# EAGLE design a2-display (EAGLE 6.6.0)
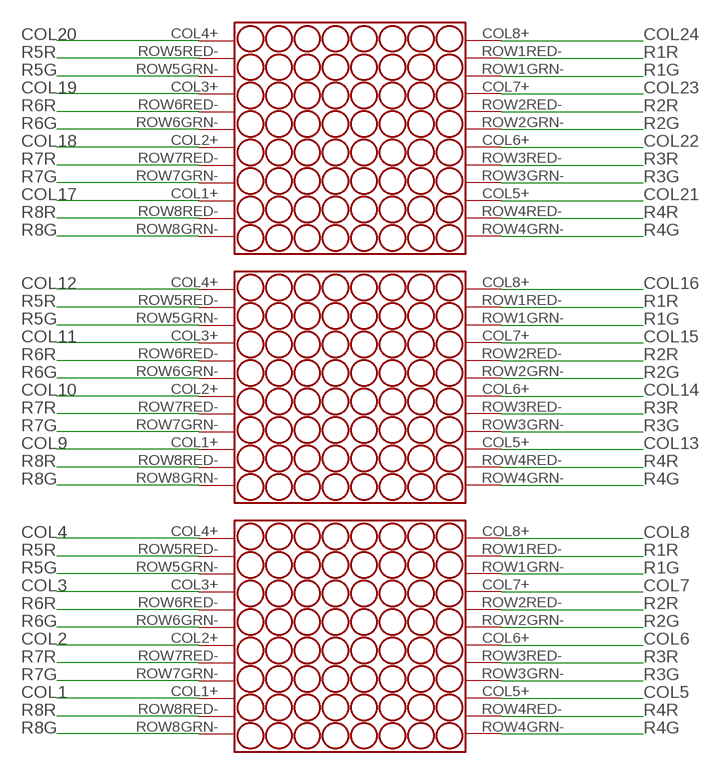
[diagram p0: schematic, sheet 1, part 1 of 2]
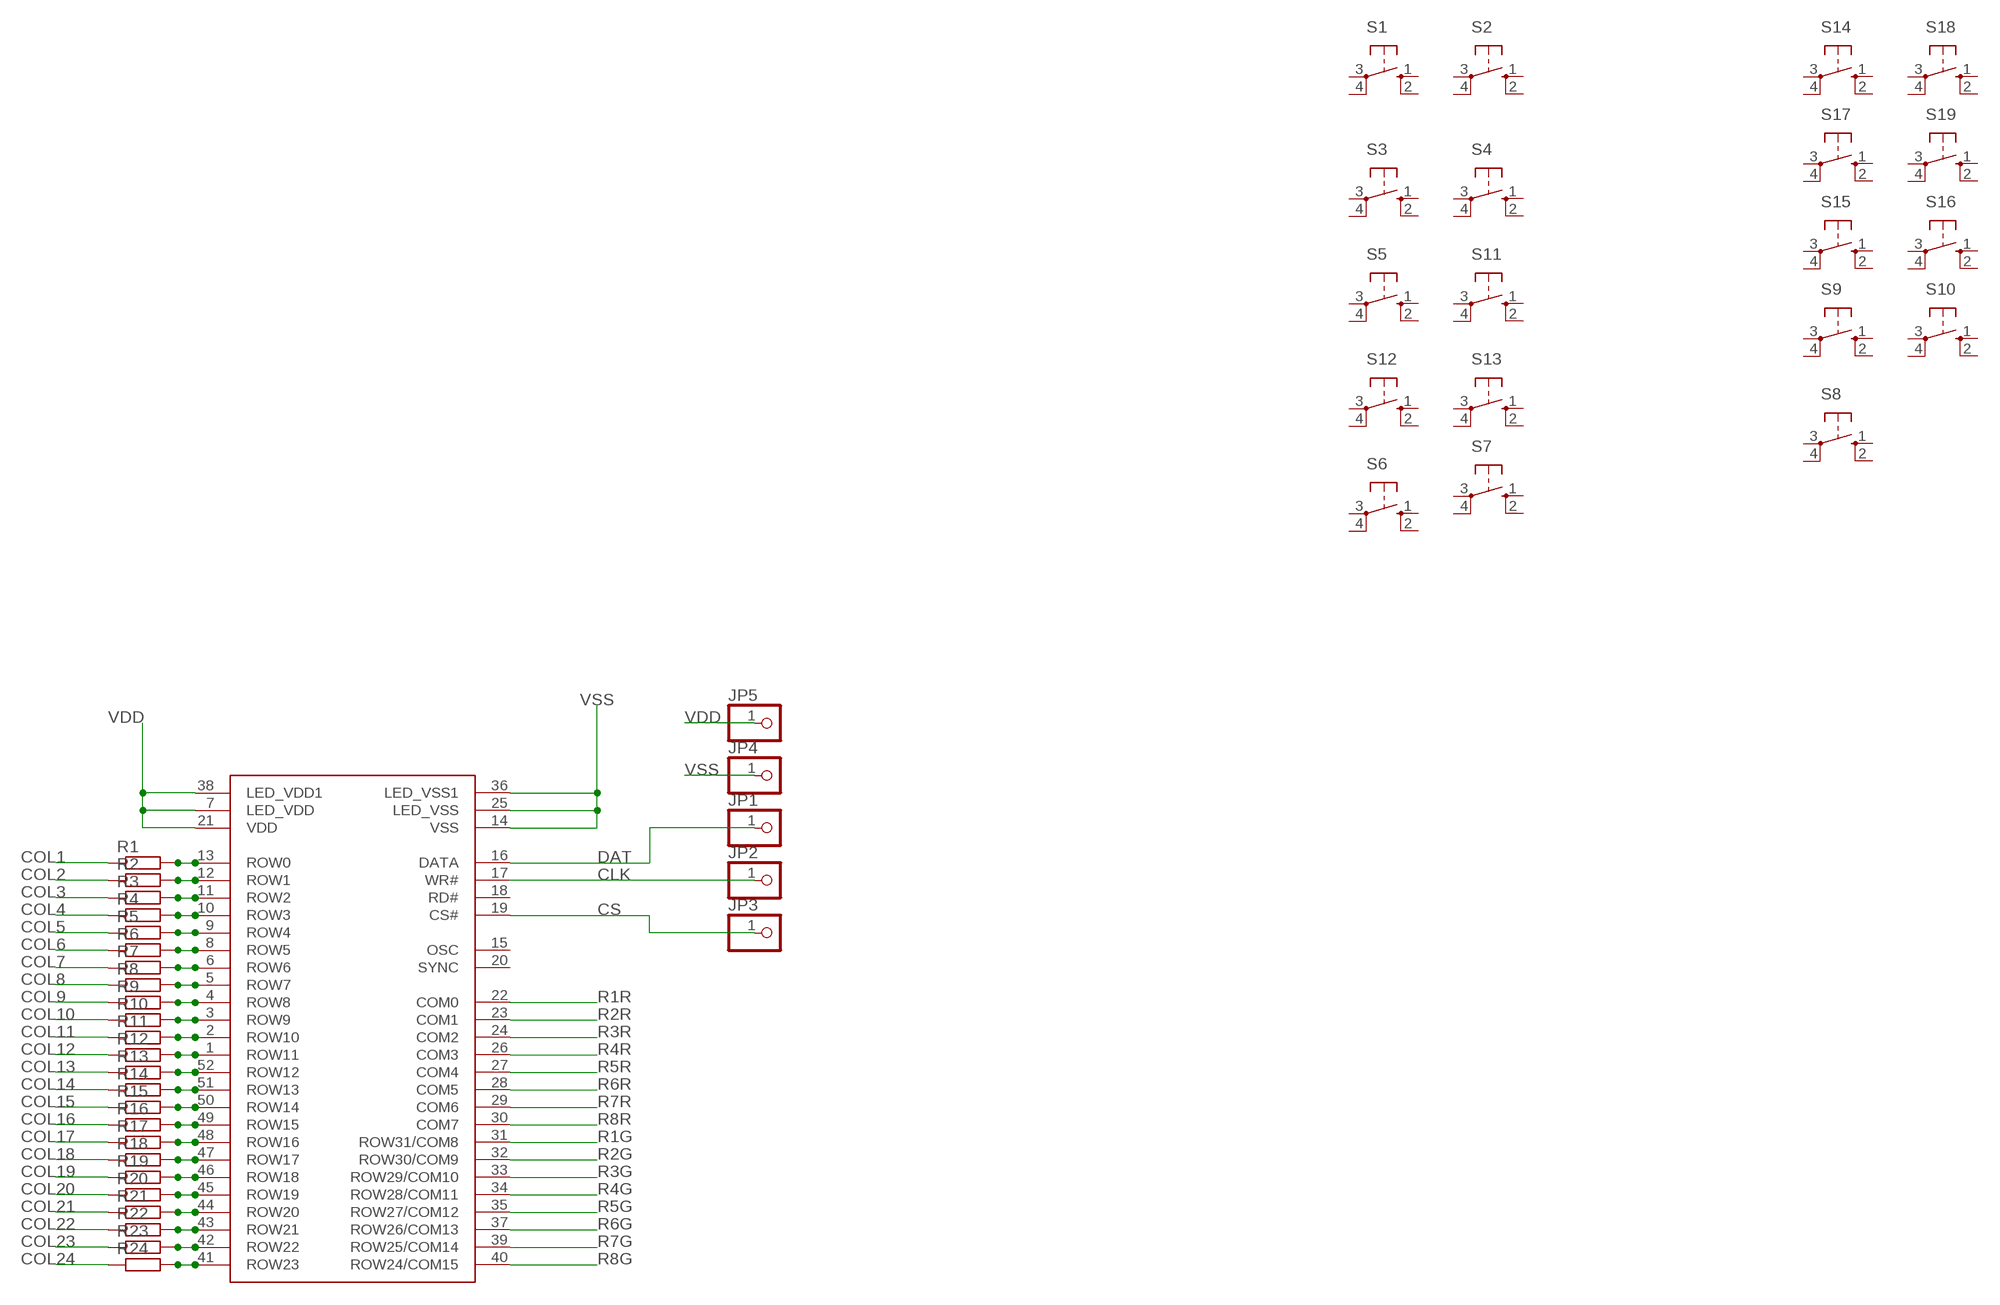
[diagram p1: schematic, sheet 1, part 2 of 2]

## Parts
IC1  HT1632C  [QFP52]
JP1  PINHD-1X1  [1X01]
JP2  PINHD-1X1  [1X01]
JP3  PINHD-1X1  [1X01]
JP4  PINHD-1X1  [1X01]
JP5  PINHD-1X1  [1X01]
R1  R-EU_R0805  [R0805]
R2  R-EU_R0805  [R0805]
R3  R-EU_R0805  [R0805]
R4  R-EU_R0805  [R0805]
R5  R-EU_R0805  [R0805]
R6  R-EU_R0805  [R0805]
R7  R-EU_R0805  [R0805]
R8  R-EU_R0805  [R0805]
R9  R-EU_R0805  [R0805]
R10  R-EU_R0805  [R0805]
R11  R-EU_R0805  [R0805]
R12  R-EU_R0805  [R0805]
R13  R-EU_R0805  [R0805]
R14  R-EU_R0805  [R0805]
R15  R-EU_R0805  [R0805]
R16  R-EU_R0805  [R0805]
R17  R-EU_R0805  [R0805]
R18  R-EU_R0805  [R0805]
R19  R-EU_R0805  [R0805]
R20  R-EU_R0805  [R0805]
R21  R-EU_R0805  [R0805]
R22  R-EU_R0805  [R0805]
R23  R-EU_R0805  [R0805]
R24  R-EU_R0805  [R0805]
S1  10-XX  [B3F-10XX]
S2  10-XX  [B3F-10XX]
S3  10-XX  [B3F-10XX]
S4  10-XX  [B3F-10XX]
S5  10-XX  [B3F-10XX]
S6  10-XX  [B3F-10XX]
S7  10-XX  [B3F-10XX]
S8  10-XX  [B3F-10XX]
S9  10-XX  [B3F-10XX]
S10  10-XX  [B3F-10XX]
S11  10-XX  [B3F-10XX]
S12  10-XX  [B3F-10XX]
S13  10-XX  [B3F-10XX]
S14  10-XX  [B3F-10XX]
S15  10-XX  [B3F-10XX]
S16  10-XX  [B3F-10XX]
S17  10-XX  [B3F-10XX]
S18  10-XX  [B3F-10XX]
S19  10-XX  [B3F-10XX]
U$1  8X8  [SURE8X8]
U$2  8X8  [SURE8X8]
U$3  8X8  [SURE8X8]

## Nets
CLK: IC1.17(WR#) JP2.1
COL1: R1.1 U$3.COL1+(COL1_AN)
COL2: R2.1 U$3.COL2+(COL2_AN)
COL3: R3.1 U$3.COL3+(COL3_AN)
COL4: R4.1 U$3.COL4+(COL4_AN)
COL5: R5.1 U$3.COL5+(COL5_AN)
COL6: R6.1 U$3.COL6+(COL6_AN)
COL7: R7.1 U$3.COL7+(COL7_AN)
COL8: R8.1 U$3.COL8+(COL8_AN)
COL9: R9.1 U$2.COL1+(COL1_AN)
COL10: R10.1 U$2.COL2+(COL2_AN)
COL11: R11.1 U$2.COL3+(COL3_AN)
COL12: R12.1 U$2.COL4+(COL4_AN)
COL13: R13.1 U$2.COL5+(COL5_AN)
COL14: R14.1 U$2.COL6+(COL6_AN)
COL15: R15.1 U$2.COL7+(COL7_AN)
COL16: R16.1 U$2.COL8+(COL8_AN)
COL17: R17.1 U$1.COL1+(COL1_AN)
COL18: R18.1 U$1.COL2+(COL2_AN)
COL19: R19.1 U$1.COL3+(COL3_AN)
COL20: R20.1 U$1.COL4+(COL4_AN)
COL21: R21.1 U$1.COL5+(COL5_AN)
COL22: R22.1 U$1.COL6+(COL6_AN)
COL23: R23.1 U$1.COL7+(COL7_AN)
COL24: R24.1 U$1.COL8+(COL8_AN)
CS: IC1.19(CS#) JP3.1
DAT: IC1.16(DATA) JP1.1
N$1: IC1.13(ROW0) R1.2
N$2: IC1.12(ROW1) R2.2
N$3: IC1.11(ROW2) R3.2
N$4: IC1.10(ROW3) R4.2
N$5: IC1.9(ROW4) R5.2
N$6: IC1.8(ROW5) R6.2
N$7: IC1.6(ROW6) R7.2
N$8: IC1.5(ROW7) R8.2
N$9: IC1.4(ROW8) R9.2
N$10: IC1.3(ROW9) R10.2
N$11: IC1.2(ROW10) R11.2
N$12: IC1.1(ROW11) R12.2
N$13: IC1.52(ROW12) R13.2
N$14: IC1.51(ROW13) R14.2
N$15: IC1.50(ROW14) R15.2
N$16: IC1.49(ROW15) R16.2
N$17: IC1.48(ROW16) R17.2
N$18: IC1.47(ROW17) R18.2
N$19: IC1.46(ROW18) R19.2
N$20: IC1.45(ROW19) R20.2
N$21: IC1.44(ROW20) R21.2
N$22: IC1.43(ROW21) R22.2
N$23: IC1.42(ROW22) R23.2
N$24: IC1.41(ROW23) R24.2
R1G: IC1.31(ROW31/COM8) U$1.ROW1GRN-(GRN1_CA) U$2.ROW1GRN-(GRN1_CA) U$3.ROW1GRN-(GRN1_CA)
R1R: IC1.22(COM0) U$1.ROW1RED-(RED1_CA) U$2.ROW1RED-(RED1_CA) U$3.ROW1RED-(RED1_CA)
R2G: IC1.32(ROW30/COM9) U$1.ROW2GRN-(GRN2_CA) U$2.ROW2GRN-(GRN2_CA) U$3.ROW2GRN-(GRN2_CA)
R2R: IC1.23(COM1) U$1.ROW2RED-(RED2_CA) U$2.ROW2RED-(RED2_CA) U$3.ROW2RED-(RED2_CA)
R3G: IC1.33(ROW29/COM10) U$1.ROW3GRN-(GRN3_CA) U$2.ROW3GRN-(GRN3_CA) U$3.ROW3GRN-(GRN3_CA)
R3R: IC1.24(COM2) U$1.ROW3RED-(RED3_CA) U$2.ROW3RED-(RED3_CA) U$3.ROW3RED-(RED3_CA)
R4G: IC1.34(ROW28/COM11) U$1.ROW4GRN-(GRN4_CA) U$2.ROW4GRN-(GRN4_CA) U$3.ROW4GRN-(GRN4_CA)
R4R: IC1.26(COM3) U$1.ROW4RED-(RED4_CA) U$2.ROW4RED-(RED4_CA) U$3.ROW4RED-(RED4_CA)
R5G: IC1.35(ROW27/COM12) U$1.ROW5GRN-(GRN5_CA) U$2.ROW5GRN-(GRN5_CA) U$3.ROW5GRN-(GRN5_CA)
R5R: IC1.27(COM4) U$1.ROW5RED-(RED5_CA) U$2.ROW5RED-(RED5_CA) U$3.ROW5RED-(RED5_CA)
R6G: IC1.37(ROW26/COM13) U$1.ROW6GRN-(GRN6_CA) U$2.ROW6GRN-(GRN6_CA) U$3.ROW6GRN-(GRN6_CA)
R6R: IC1.28(COM5) U$1.ROW6RED-(RED6_CA) U$2.ROW6RED-(RED6_CA) U$3.ROW6RED-(RED6_CA)
R7G: IC1.39(ROW25/COM14) U$1.ROW7GRN-(GRN7_CA) U$2.ROW7GRN-(GRN7_CA) U$3.ROW7GRN-(GRN7_CA)
R7R: IC1.29(COM6) U$1.ROW7RED-(RED7_CA) U$2.ROW7RED-(RED7_CA) U$3.ROW7RED-(RED7_CA)
R8G: IC1.40(ROW24/COM15) U$1.ROW8GRN-(GRN8_CA) U$2.ROW8GRN-(GRN8_CA) U$3.ROW8GRN-(GRN8_CA)
R8R: IC1.30(COM7) U$1.ROW8RED-(RED8_CA) U$2.ROW8RED-(RED8_CA) U$3.ROW8RED-(RED8_CA)
VDD: IC1.7(LED_VDD) IC1.21(VDD) IC1.38(LED_VDD1) JP5.1
VSS: IC1.14(VSS) IC1.25(LED_VSS) IC1.36(LED_VSS1) JP4.1
Unconnected: IC1.15(OSC) IC1.18(RD#) IC1.20(SYNC) S1.1(S) S1.2(S1) S1.3(P) S1.4(P1) S2.1(S) S2.2(S1) S2.3(P) S2.4(P1) S3.1(S) S3.2(S1) S3.3(P) S3.4(P1) S4.1(S) S4.2(S1) S4.3(P) S4.4(P1) S5.1(S) S5.2(S1) S5.3(P) S5.4(P1) S6.1(S) S6.2(S1) S6.3(P) S6.4(P1) S7.1(S) S7.2(S1) S7.3(P) S7.4(P1) S8.1(S) S8.2(S1) S8.3(P) S8.4(P1) S9.1(S) S9.2(S1) S9.3(P) S9.4(P1) S10.1(S) S10.2(S1) S10.3(P) S10.4(P1) S11.1(S) S11.2(S1) S11.3(P) S11.4(P1) S12.1(S) S12.2(S1) S12.3(P) S12.4(P1) S13.1(S) S13.2(S1) S13.3(P) S13.4(P1) S14.1(S) S14.2(S1) S14.3(P) S14.4(P1) S15.1(S) S15.2(S1) S15.3(P) S15.4(P1) S16.1(S) S16.2(S1) S16.3(P) S16.4(P1) S17.1(S) S17.2(S1) S17.3(P) S17.4(P1) S18.1(S) S18.2(S1) S18.3(P) S18.4(P1) S19.1(S) S19.2(S1) S19.3(P) S19.4(P1)

## Library data of the parts
IC1 = jason_eagle6:HT1632C
JP1-JP5 = pinhead:PINHD-1X1: PIN HEADER
R1-R24 = rcl:R-EU_: RESISTOR, European symbol
S1-S19 = switch-omron:10-XX: OMRON SWITCH; MPN: B3F-1000; OC_FARNELL: 176432; OC_NEWARK: 36M3542
U$1-U$3 = jasons_stuff:8X8: Sure Electronics 8x8 Bi Colour LED matrix

## Board
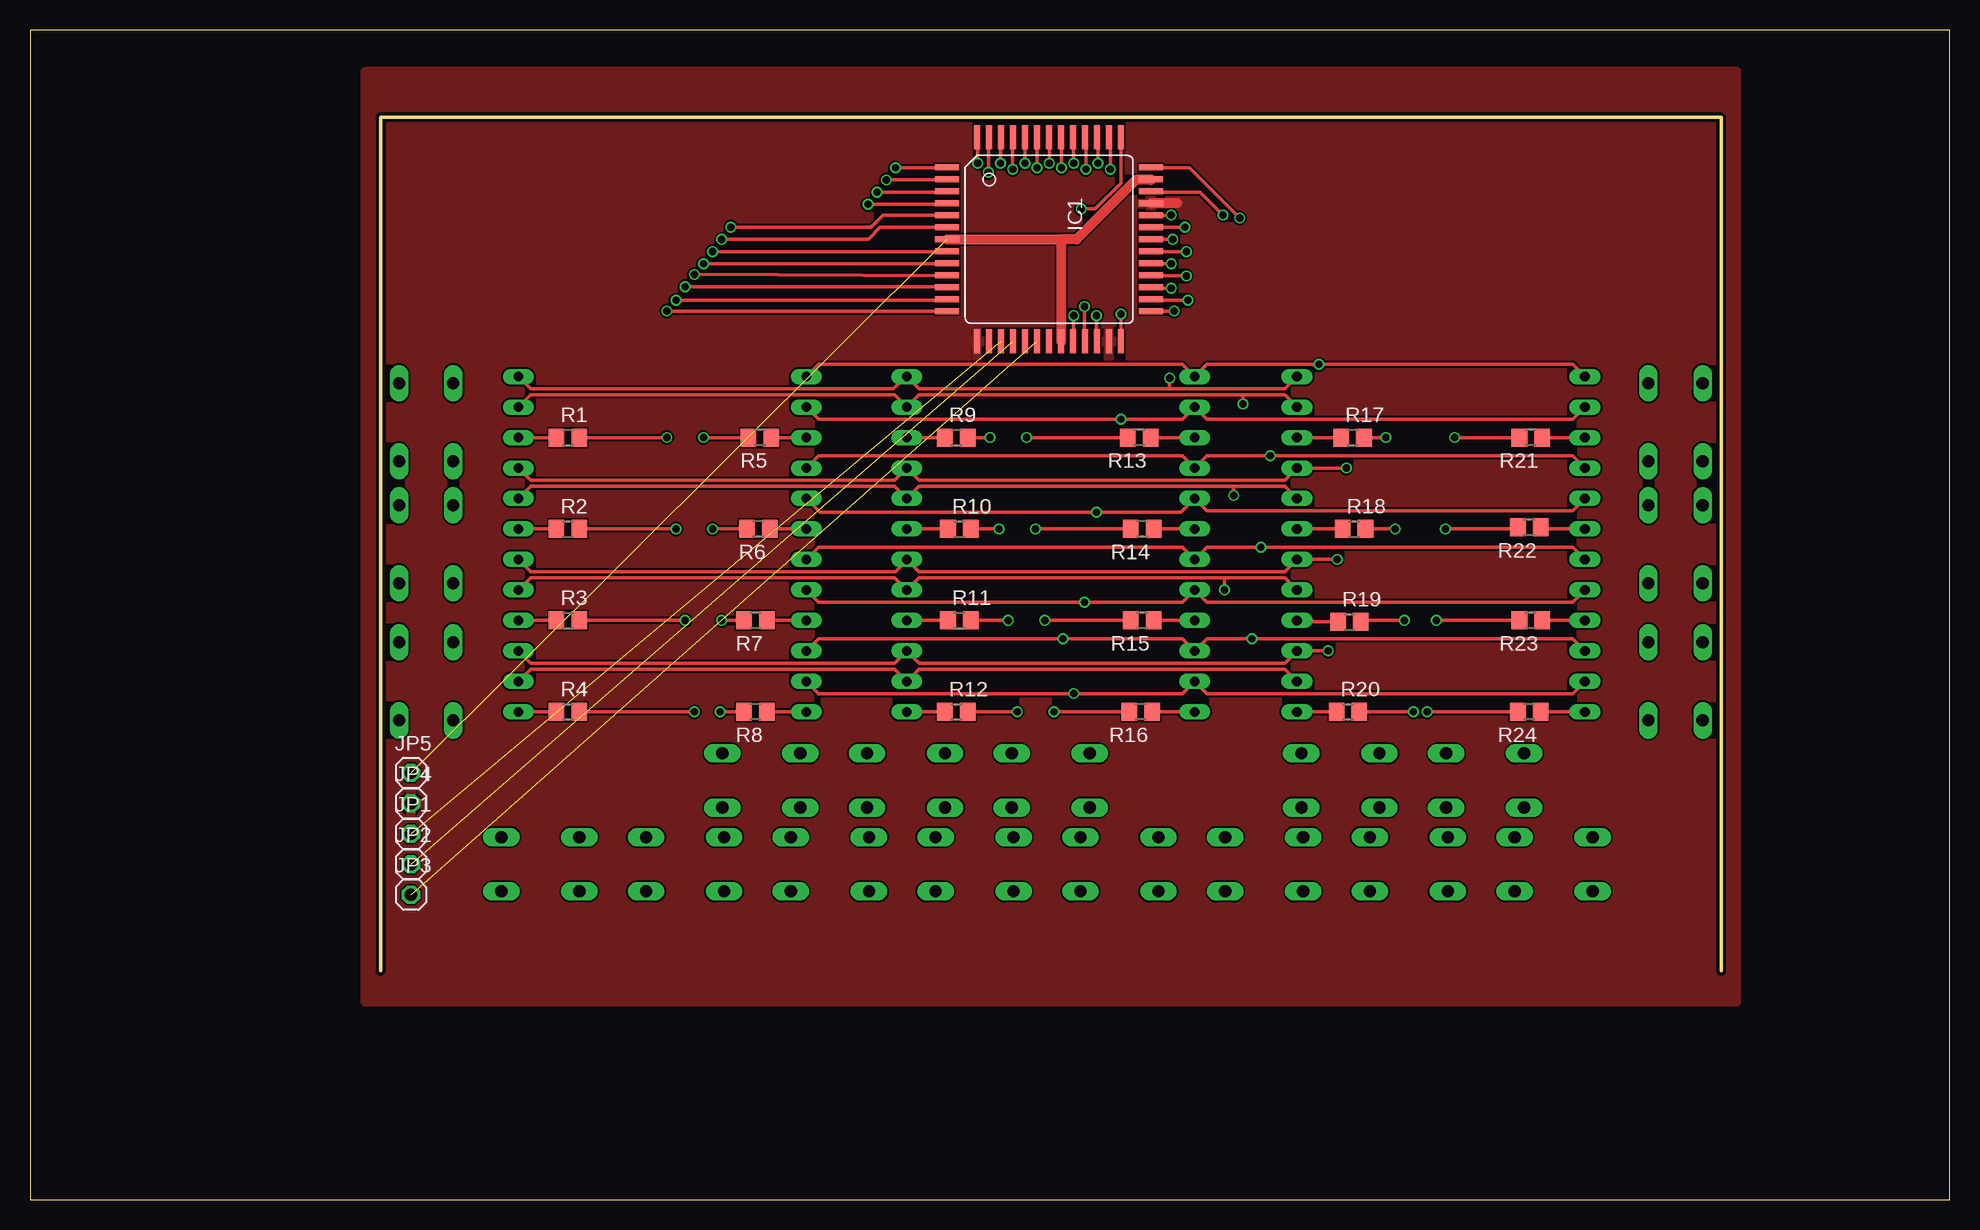
[diagram p2: board, top side]
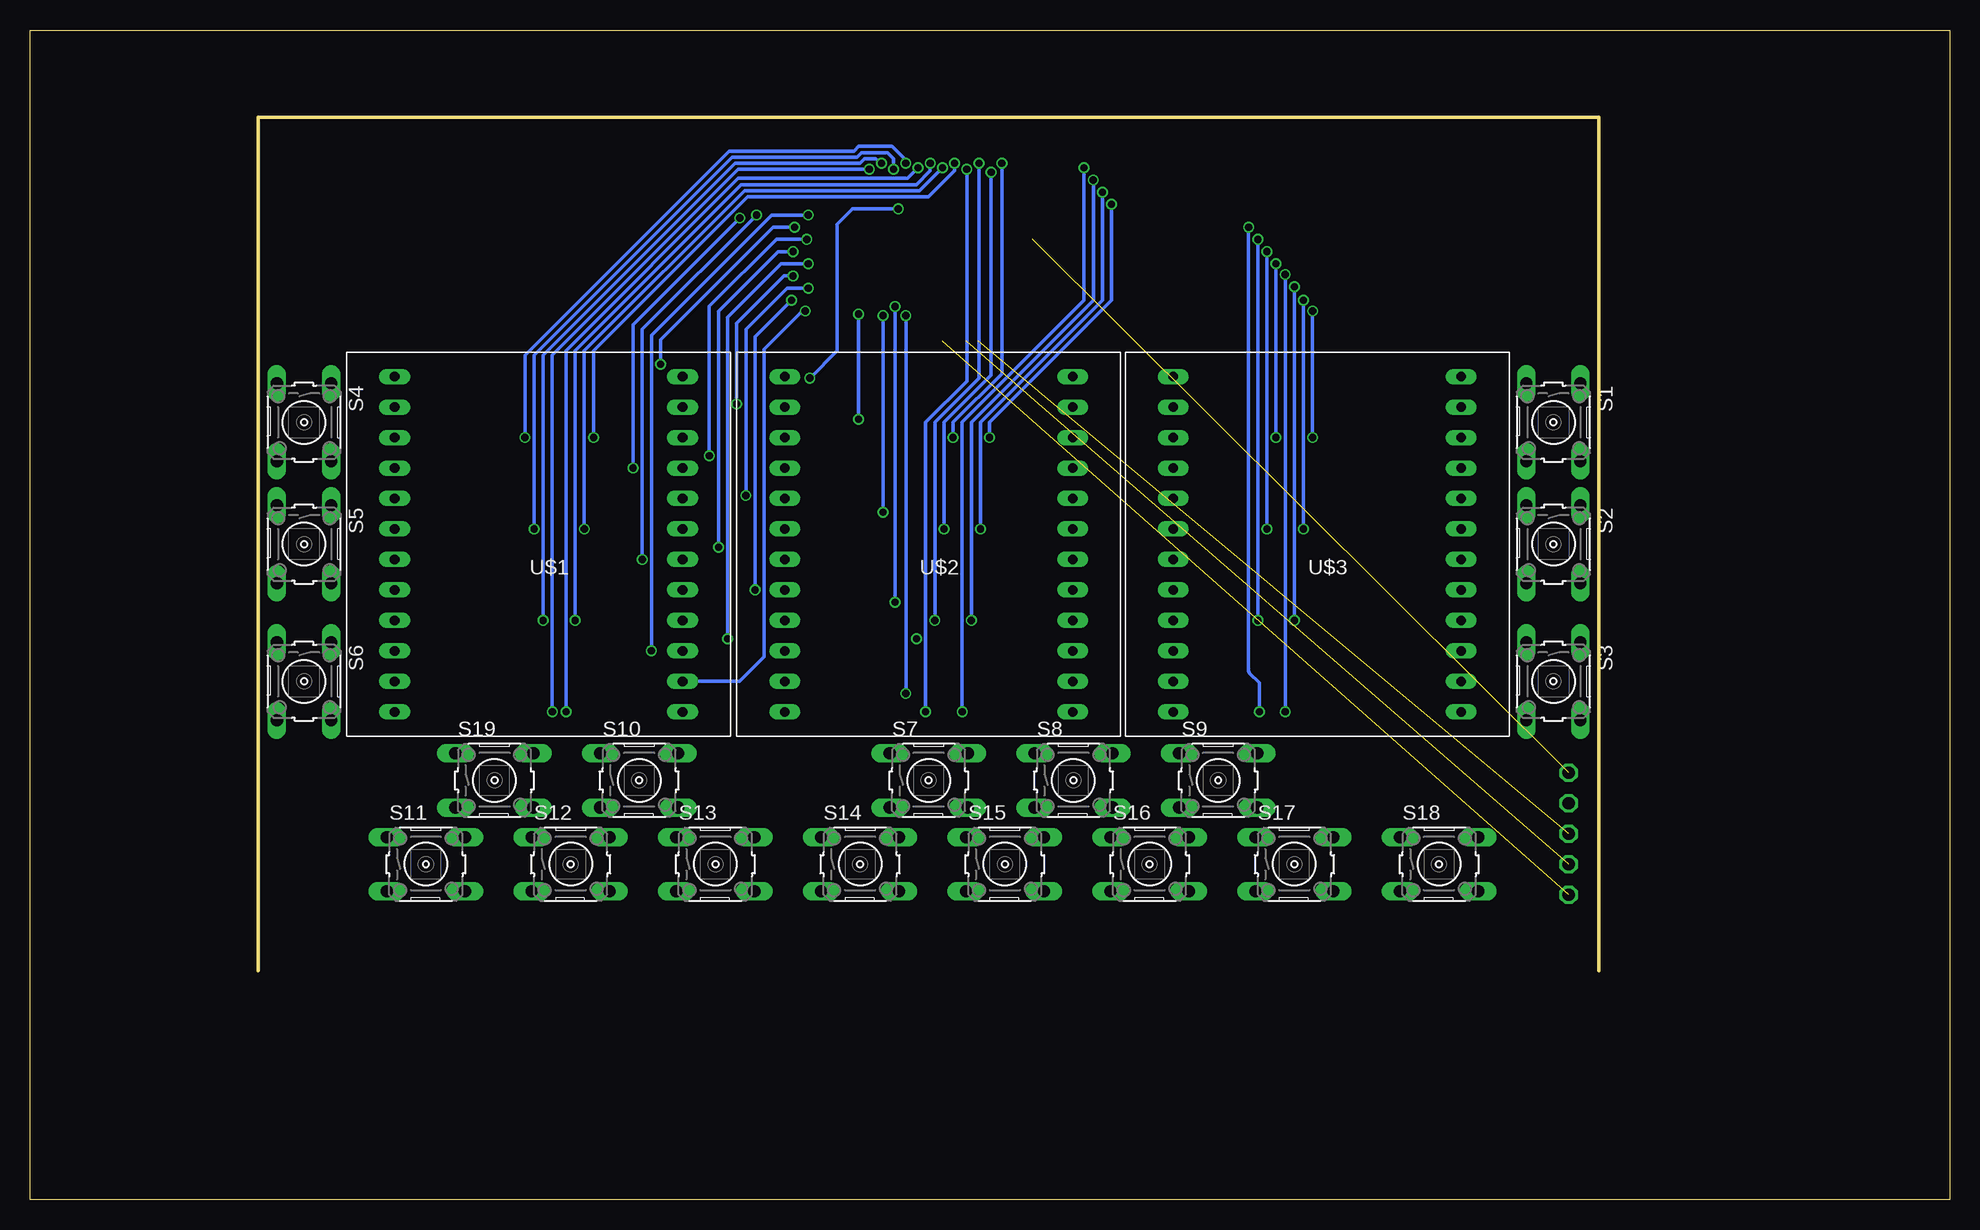
[diagram p3: board, bottom side, seen from below]

Size 160 x 97.46 mm. Coordinates in mm from the lower left corner, seen from the top.
Outline: 29.21,19.05 29.21,90.17 140.97,90.17 140.97,19.05
Outline: 0,0 160,0 160,97.46 0,97.46 0,0
Copper layers (1*16): Top 0.035mm / dielectric 1.5mm / Bottom 0.035mm
Design rules "ITEADstudio_DRC": minimum track width 6mil, minimum drill 12mil, track to track 6mil, track to pad 6mil, pad to pad 6mil, via to via 6mil, smd to smd 0mil, copper to edge 10mil, drill to drill 10mil, minimum pad ring 10mil, minimum via ring 6mil, stop-mask expansion 2mil, vias tented up to drill 100mil, thermal gap 10mil

### Footprints (pad centres in the part's own frame; a part is rotated, then mirrored left to right if it is on the bottom)
QFP52 = smd 0.5 x 2: 1 -6,-8; 2 -5,-8; 3 -4,-8; 4 -3,-8; 5 -2,-8; 6 -1,-8; 7 0,-8; 8 1,-8; 9 2,-8; 10 3,-8; 11 4,-8; 12 5,-8; 13 6,-8; 27 6,9; 28 5,9; 29 4,9; 30 3,9; 31 2,9; 32 1,9; 33 0,9; 34 -1,9; 35 -2,9; 36 -3,9; 37 -4,9; 38 -5,9; 39 -6,9 | smd 2 x 0.5: 14 8.5,-5.5; 15 8.5,-4.5; 16 8.5,-3.5; 17 8.5,-2.5; 18 8.5,-1.5; 19 8.5,-0.5; 20 8.5,0.5; 21 8.5,1.5; 22 8.5,2.5; 23 8.5,3.5; 24 8.5,4.5; 25 8.5,5.5; 26 8.5,6.5; 40 -8.5,6.5; 41 -8.5,5.5; 42 -8.5,4.5; 43 -8.5,3.5; 44 -8.5,2.5; 45 -8.5,1.5; 46 -8.5,0.5; 47 -8.5,-0.5; 48 -8.5,-1.5; 49 -8.5,-2.5; 50 -8.5,-3.5; 51 -8.5,-4.5; 52 -8.5,-5.5
1X01 = drill 1.016 octagon: 1 0,0
R0805 = smd 1.3 x 1.5: 1 -0.95,0; 2 0.95,0
B3F-10XX = drill 1.016 long: 1 -3.251,2.261; 2 3.251,2.261; 3 -3.251,-2.261; 4 3.251,-2.261
SURE8X8 = drill 0.8 long: COL1+ -12.002,-7.62; COL2+ -12.002,0; COL3+ -12.002,7.62; COL4+ -12.002,15.24; COL5+ 12.002,-7.62; COL6+ 12.002,0; COL7+ 12.002,7.62; COL8+ 12.002,15.24; ROW1GRN- 12.002,10.16; ROW1RED- 12.002,12.7; ROW2GRN- 12.002,2.54; ROW2RED- 12.002,5.08; ROW3GRN- 12.002,-5.08; ROW3RED- 12.002,-2.54; ROW4GRN- 12.002,-12.7; ROW4RED- 12.002,-10.16; ROW5GRN- -12.002,10.16; ROW5RED- -12.002,12.7; ROW6GRN- -12.002,2.54; ROW6RED- -12.002,5.08; ROW7GRN- -12.002,-5.08; ROW7RED- -12.002,-2.54; ROW8GRN- -12.002,-12.7; ROW8RED- -12.002,-10.16

### Placement (x,y rotation side)
IC1  84.45,80.01 270 top
JP1  31.75,30.48 0 top
JP2  31.75,27.94 0 top
JP3  31.75,25.4 0 top
JP4  31.75,33.02 0 top
JP5  31.75,35.56 0 top
R1  44.83,63.5 0 top
R2  44.83,55.88 0 top
R3  44.83,48.26 0 top
R4  44.83,40.64 0 top
R5  60.83,63.5 180 top
R6  60.71,55.88 180 top
R7  60.45,48.26 180 top
R8  60.45,40.64 180 top
R9  77.22,63.5 0 top
R10  77.47,55.88 0 top
R11  77.47,48.26 0 top
R12  77.22,40.64 0 top
R13  92.46,63.5 180 top
R14  92.71,55.88 180 top
R15  92.71,48.26 180 top
R16  92.58,40.64 180 top
R17  110.24,63.5 0 top
R18  110.36,55.88 0 top
R19  109.98,48.13 0 top
R20  109.86,40.64 0 top
R21  125.09,63.5 180 top
R22  124.97,56.01 180 top
R23  125.09,48.26 180 top
R24  124.97,40.64 180 top
S1  33.02,64.77 270 bottom
S2  33.02,54.61 270 bottom
S3  33.02,43.18 270 bottom
S4  137.16,64.77 270 bottom
S5  137.16,54.61 270 bottom
S6  137.16,43.18 270 bottom
S7  85.09,34.93 0 bottom
S8  73.03,34.93 0 bottom
S9  60.96,34.93 0 bottom
S10  109.22,34.93 0 bottom
S11  127,27.94 0 bottom
S12  114.94,27.94 0 bottom
S13  102.87,27.94 0 bottom
S14  90.81,27.94 0 bottom
S15  78.74,27.94 0 bottom
S16  66.67,27.94 0 bottom
S17  54.61,27.94 0 bottom
S18  42.55,27.94 0 bottom
S19  121.28,34.93 0 bottom
U$1  117.6,55.88 180 bottom
U$2  85.09,55.88 180 bottom
U$3  52.7,55.88 180 bottom

### Tracks (layer width: path | path; a pad name or v marks a point on that pad's centre or on a via)
CLK  (1 unrouted)
COL1
  Top 0.305: U$3.COL1+ R1.1
COL2
  Top 0.305: U$3.COL2+ R2.1
COL3
  Top 0.305: U$3.COL3+ R3.1
COL4
  Top 0.305: U$3.COL4+ R4.1
COL5
  Top 0.305: U$3.COL5+ R5.1
COL6
  Top 0.305: U$3.COL6+ R6.1
COL7
  Top 0.305: U$3.COL7+ R7.1
COL8
  Top 0.305: U$3.COL8+ R8.1
COL9
  Top 0.305: U$2.COL1+ R9.1
COL10
  Top 0.305: U$2.COL2+ R10.1
COL11
  Top 0.305: U$2.COL3+ R11.1
COL12
  Top 0.305: U$2.COL4+ R12.1
COL13
  Top 0.305: R13.1 U$2.COL5+
COL14
  Top 0.305: R14.1 U$2.COL6+
COL15
  Top 0.305: R15.1 U$2.COL7+
COL16
  Top 0.305: R16.1 U$2.COL8+
COL17
  Top 0.305: U$1.COL1+ R17.1
COL18
  Top 0.305: U$1.COL2+ R18.1
COL19
  Top 0.305: U$1.COL3+ 105.73,48.13 R19.1
COL20
  Top 0.305: U$1.COL4+ R20.1
COL21
  Top 0.305: R21.1 U$1.COL5+
COL22
  Top 0.305: R22.1 126.05,55.88 U$1.COL6+
COL23
  Top 0.305: R23.1 U$1.COL7+
COL24
  Top 0.305: R24.1 U$1.COL8+
CS  (1 unrouted)
DAT  (1 unrouted)
N$1  (via drill 0.6 pad 0.3)
  Top 0.305: IC1.13 76.42,74.04 v53.09,74.04 | R1.2 v53.09,63.5
  Bottom 0.305: v53.09,63.5 v53.09,74.04
N$2  (via drill 0.6 pad 0.3)
  Top 0.305: IC1.12 76.38,74.93 v53.85,74.93 | R2.2 v53.85,55.88
  Bottom 0.305: v53.85,55.88 v53.85,74.93
N$3  (via drill 0.6 pad 0.3)
  Top 0.305: IC1.11 76.39,76.07 v54.61,76.07 | R3.2 v54.61,48.26
  Bottom 0.305: v54.61,48.26 v54.61,76.07
N$4  (via drill 0.6 pad 0.3)
  Top 0.305: IC1.10 76.41,76.96 v55.37,77.09 | R4.2 v55.37,40.64
  Bottom 0.305: v55.37,40.64 v55.37,77.09
N$5  (via drill 0.6 pad 0.3)
  Top 0.305: IC1.9 76.42,77.98 v56.13,77.98 | R5.2 v56.13,63.5
  Bottom 0.305: v56.13,63.5 v56.13,77.98
N$6  (via drill 0.6 pad 0.3)
  Top 0.305: IC1.8 76.44,78.99 v56.9,78.99 | R6.2 v56.9,55.88
  Bottom 0.305: v56.9,55.88 v56.9,78.99
N$7  (via drill 0.6 pad 0.3)
  Top 0.305: IC1.6 76.44,81.03 70.87,81.03 69.92,80.08 arc-45 69.75,80.01 v57.66,80.01 | R7.2 v57.66,48.26
  Bottom 0.305: v57.66,48.26 v57.66,80.01
N$8  (via drill 0.6 pad 0.3)
  Top 0.305: IC1.5 76.42,82.04 71.12,82.04 70.18,81.1 arc-45 70,81.03 v58.42,81.03 | R8.2 v57.53,40.64
  Bottom 0.305: v57.53,40.64 57.53,43.05 58.35,43.87 arc45 58.42,44.05 v58.42,81.03
N$9  (via drill 0.6 pad 0.3)
  Top 0.305: IC1.4 76.38,82.93 v69.85,82.93 | R9.2 v80.01,63.5
  Bottom 0.305: v80.01,63.5 80.01,64.77 69.85,74.93 v69.85,82.93
N$10  (via drill 0.6 pad 0.3)
  Top 0.305: IC1.3 76.39,83.95 v70.61,83.95 | R10.2 v80.77,55.88
  Bottom 0.305: v80.77,55.88 80.77,64.77 70.61,74.93 v70.61,83.95
N$11  (via drill 0.6 pad 0.3)
  Top 0.305: IC1.2 76.41,84.96 v71.37,84.96 | R11.2 v81.53,48.26
  Bottom 0.305: v81.53,48.26 81.53,64.77 71.37,74.93 v71.37,84.96
N$12  (via drill 0.6 pad 0.3)
  Top 0.305: IC1.1 76.42,85.98 v72.14,85.98 | R12.2 v82.3,40.64
  Bottom 0.305: v82.3,40.64 82.3,64.77 72.14,74.93 v72.14,85.98
N$13  (via drill 0.6 pad 0.3)
  Top 0.305: R13.2 v83.06,63.5 | IC1.52 arc-45 78.99,88.42 v78.99,86.36
  Bottom 0.305: v78.99,86.36 78.99,68.83 83.06,64.77 v83.06,63.5
N$14  (via drill 0.6 pad 0.3)
  Top 0.305: R14.2 v83.82,55.88 | IC1.51 79.88,88.44 v79.88,85.6
  Bottom 0.305: v79.88,85.6 79.88,68.71 83.82,64.77 v83.82,55.88
N$15  (via drill 0.6 pad 0.3)
  Top 0.305: R15.2 v84.58,48.26 | IC1.50 80.9,88.45 v80.9,86.36
  Bottom 0.305: v80.9,86.36 80.9,68.45 84.58,64.77 v84.58,48.26
N$16  (via drill 0.6 pad 0.3)
  Top 0.305: R16.2 v85.34,40.64 | IC1.49 81.92,88.47 v81.92,85.85
  Bottom 0.305: v81.92,85.85 81.92,68.2 85.34,64.77 v85.34,40.64
N$17  (via drill 0.6 pad 0.3)
  Top 0.305: IC1.48 82.93,88.49 v82.93,86.36 | R17.2 v113.03,63.5
  Bottom 0.305: v113.03,63.5 113.03,70.74 100.2,83.57 85.09,83.57 82.93,85.72 v82.93,86.36
N$18  (via drill 0.6 pad 0.3)
  Top 0.305: IC1.47 v83.95,85.98 | R18.2 v113.79,55.88
  Bottom 0.305: v113.79,55.88 113.79,70.74 100.46,84.07 96.9,84.07 96.52,84.07 85.85,84.07 v83.95,85.98
N$19  (via drill 0.6 pad 0.3)
  Top 0.305: IC1.46 84.96,88.5 v84.96,86.36 | R19.2 111.06,48.26 v114.55,48.26
  Bottom 0.305: v114.55,48.26 114.55,70.74 100.71,84.58 86.11,84.58 84.96,85.72 v84.96,86.36
N$20  (via drill 0.6 pad 0.3)
  Top 0.305: IC1.45 85.98,88.49 v85.98,85.98 | R20.2 v115.32,40.64
  Bottom 0.305: v115.32,40.64 115.32,70.74 100.97,85.09 86.87,85.09 v85.98,85.98
N$21  (via drill 0.6 pad 0.3)
  Top 0.305: IC1.44 87,88.47 v87,86.36 | R21.2 v118.75,63.5
  Bottom 0.305: v87,86.36 87,86.61 88.14,87.76 90.93,87.76 91.31,87.38 101.73,87.38 118.75,70.36 v118.75,63.5
N$22  (via drill 0.6 pad 0.3)
  Top 0.305: IC1.43 88.01,88.45 v88.01,85.85 | R22.2 123.89,55.88 v117.98,55.88
  Bottom 0.305: v88.01,85.85 88.01,86.74 88.52,87.25 90.68,87.25 91.06,86.87 101.47,86.87 117.98,70.36 v117.98,55.88
N$23  (via drill 0.6 pad 0.3)
  Top 0.305: IC1.42 89.03,88.44 v89.03,86.36 | R23.2 v117.22,48.26
  Bottom 0.305: v117.22,48.26 117.22,70.36 101.22,86.36 90.81,86.36 90.42,86.74 89.53,86.74 v89.03,86.36
N$24  (via drill 0.6 pad 0.3)
  Top 0.305: IC1.41 90.04,88.42 v90.04,85.85 | R24.2 v116.46,40.64
  Bottom 0.305: v116.46,40.64 116.46,70.36 100.97,85.85 v90.04,85.85
R1G  (via drill 0.6 pad 0.3)
  Top 0.305: U$3.ROW1GRN- 65.72,46.74 v86.11,46.74 96.08,46.74 U$2.ROW1GRN- 98.11,46.74 v101.85,46.74 128.59,46.74 U$1.ROW1GRN- | IC1.31 93.49,77.98 v95.12,77.98
  Bottom 0.305: v95.12,77.98 97.41,77.98 101.85,73.53 v101.85,46.74
R1R  (via drill 0.6 pad 0.3)
  Top 0.305: U$3.ROW1RED- 65.72,42.16 v87,42.16 96.08,42.16 U$2.ROW1RED- 98.11,42.16 128.59,42.16 U$1.ROW1RED- | IC1.22 87,71.55 v87,73.66
  Bottom 0.305: v87,73.66 v87,42.16
R2G  (via drill 0.6 pad 0.3)
  Top 0.305: U$3.ROW2GRN- 65.72,54.36 96.08,54.36 U$2.ROW2GRN- 98.11,54.36 v102.62,54.36 128.59,54.36 U$1.ROW2GRN- | IC1.32 93.47,78.99 v96.39,78.99
  Bottom 0.305: v96.39,78.99 97.66,78.99 102.62,74.04 v102.62,54.36
R2R  (via drill 0.6 pad 0.3)
  Top 0.305: U$3.ROW2RED- 65.72,49.78 v87.88,49.78 96.08,49.78 U$2.ROW2RED- 98.11,49.78 128.59,49.78 U$1.ROW2RED- | IC1.23 87.88,71.58 v87.88,74.42
  Bottom 0.305: v87.88,74.42 v87.88,49.78
R3G  (via drill 0.6 pad 0.3)
  Top 0.305: U$3.ROW3GRN- 65.72,61.98 96.08,61.98 U$2.ROW3GRN- 98.11,61.98 v103.38,61.98 128.59,61.98 U$1.ROW3GRN- | IC1.33 v95.25,80.01
  Bottom 0.305: v95.25,80.01 97.79,80.01 103.38,74.42 v103.38,61.98
R3R  (via drill 0.6 pad 0.25)
  Top 0.305: U$3.ROW3RED- 65.85,57.28 85.09,57.28 v88.9,57.28 95.95,57.28 U$2.ROW3RED- 98.11,57.4 128.59,57.4 U$1.ROW3RED- | IC1.24 88.9,71.56 v88.9,73.66
  Bottom 0.305: v88.9,73.66 v88.9,57.28
R4G  (via drill 0.6 pad 0.3)
  Top 0.305: U$3.ROW4GRN- 65.72,69.6 96.08,69.6 U$2.ROW4GRN- 98.11,69.6 v107.44,69.6 128.59,69.6 U$1.ROW4GRN- | IC1.34 93.47,81.03 v96.27,81.03
  Bottom 0.305: v107.44,69.6 107.44,71.63 98.04,81.03 v96.27,81.03
R4R  (via drill 0.6 pad 0.3)
  Top 0.305: U$3.ROW4RED- 65.72,65.02 v90.93,65.02 96.08,65.02 U$2.ROW4RED- 98.11,65.02 128.59,65.02 U$1.ROW4RED- | IC1.26 90.93,71.53 v90.93,73.79
  Bottom 0.305: v90.93,73.79 v90.93,65.02
R5G  (via drill 0.6 pad 0.3)
  Top 0.305: U$3.ROW5GRN- 41.72,44.7 72.07,44.7 U$2.ROW5GRN- 74.11,44.7 104.58,44.7 U$1.ROW5GRN- v108.2,45.72 | IC1.35 93.49,82.04 v95.12,82.04
  Bottom 0.305: v108.2,45.72 108.2,69.85 108.2,70.87 108.2,72.01 98.17,82.04 v95.12,82.04
R5R  (via drill 0.6 pad 0.3)
  Top 0.305: U$3.ROW5RED- 41.72,44.2 72.07,44.2 U$2.ROW5RED- 74.11,44.2 104.58,44.2 U$1.ROW5RED- | IC1.27 arc-45 93.53,74.04 v95.38,74.04
  Bottom 0.305: v95.38,74.04 95.63,74.04 98.81,70.87 98.81,45.21 100.84,43.18 U$1.ROW5RED-
R6G  (via drill 0.6 pad 0.3)
  Top 0.305: U$3.ROW6GRN- 41.72,52.32 72.14,52.32 73.09,53.28 U$2.ROW6GRN- 74.11,52.32 104.58,52.32 U$1.ROW6GRN- v108.97,53.34 | IC1.37 arc45 93.61,83.95 97.54,83.95 v99.44,82.04
  Bottom 0.305: v108.97,53.34 108.97,72.52 v99.44,82.04
R6R  (via drill 0.6 pad 0.3)
  Top 0.305: U$3.ROW6RED- 41.72,51.82 72.07,51.82 U$2.ROW6RED- 74.11,51.82 99.57,51.82 | U$1.ROW6RED- 104.58,51.82 99.57,51.82 | IC1.28 93.53,74.93 v96.52,74.93 | v99.57,50.8 99.57,51.82
  Bottom 0.305: v99.57,50.8 99.57,71.88 v96.52,74.93
R7G  (via drill 0.6 pad 0.3)
  Top 0.305: U$3.ROW7GRN- 41.72,59.94 72.07,59.94 U$2.ROW7GRN- 74.11,59.94 104.58,59.94 U$1.ROW7GRN- v109.73,60.96 | IC1.39 arc45 93.53,85.98 96.65,85.98 v100.84,81.79
  Bottom 0.305: v109.73,60.96 109.73,72.9 v100.84,81.79
R7R  (via drill 0.6 pad 0.3)
  Top 0.305: U$3.ROW7RED- 41.72,59.44 72.07,59.44 U$2.ROW7RED- 74.11,59.44 100.33,59.44 | 100.33,59.44 104.58,59.44 U$1.ROW7RED- | IC1.29 arc45 93.61,75.95 v95.12,75.95 | v100.33,58.67 100.33,59.44
  Bottom 0.305: v95.12,75.95 96.9,75.95 100.33,72.52 v100.33,58.67
R8G  (via drill 0.6 pad 0.3)
  Top 0.305: U$3.ROW8GRN- 41.72,67.56 71.94,67.56 U$2.ROW8GRN- 74.11,67.56 95,67.56 | 95,67.56 104.58,67.56 U$1.ROW8GRN- | v95,68.45 95,67.56 | IC1.40 90.93,88.49 90.93,84.71 88.77,82.55 v87.63,82.55
  Bottom 0.305: v95,68.45 92.71,70.74 92.71,81.28 91.44,82.55 v87.63,82.55
R8R  (via drill 0.6 pad 0.3)
  Top 0.305: U$3.ROW8RED- 41.72,67.06 72.07,67.06 U$2.ROW8RED- 74.11,67.06 101.09,67.06 | U$1.ROW8RED- 104.58,67.06 101.09,67.06 | 93.34,76.96 arc45 IC1.30 93.5,76.96 v96.39,76.96 | v101.09,66.29 101.09,67.06
  Bottom 0.305: v96.39,76.96 97.16,76.96 101.09,73.02 v101.09,66.29
VDD  (1 unrouted)
  Top 0.305: IC1.38 IC1.38 arc-45 93.64,85.09
  Top 0.813: IC1.7 85.98,80.01 | IC1.21 85.98,71.53 85.98,80.01 | IC1.38 93.41,84.96 92.2,84.96 87.25,80.01 85.98,80.01
VSS
  Top 0.305: IC1.36 arc-45 93.57,83.06
  Top 0.813: IC1.36 93.5,83.06 95.63,83.06
  pour Top: 27.94,91.44 27.94,16.51 142.24,16.51 142.24,45.72 142.24,93.98 27.94,93.98